# EAGLE design apple_all (EAGLE 9.6.1)
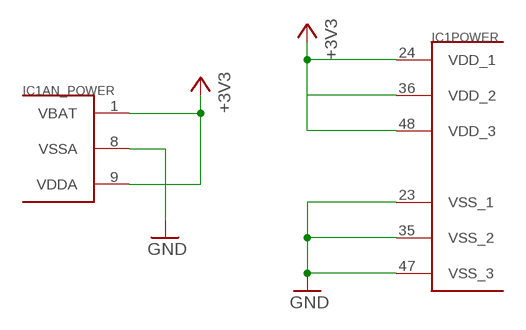
[diagram p0: schematic, sheet 1, part 1 of 2]
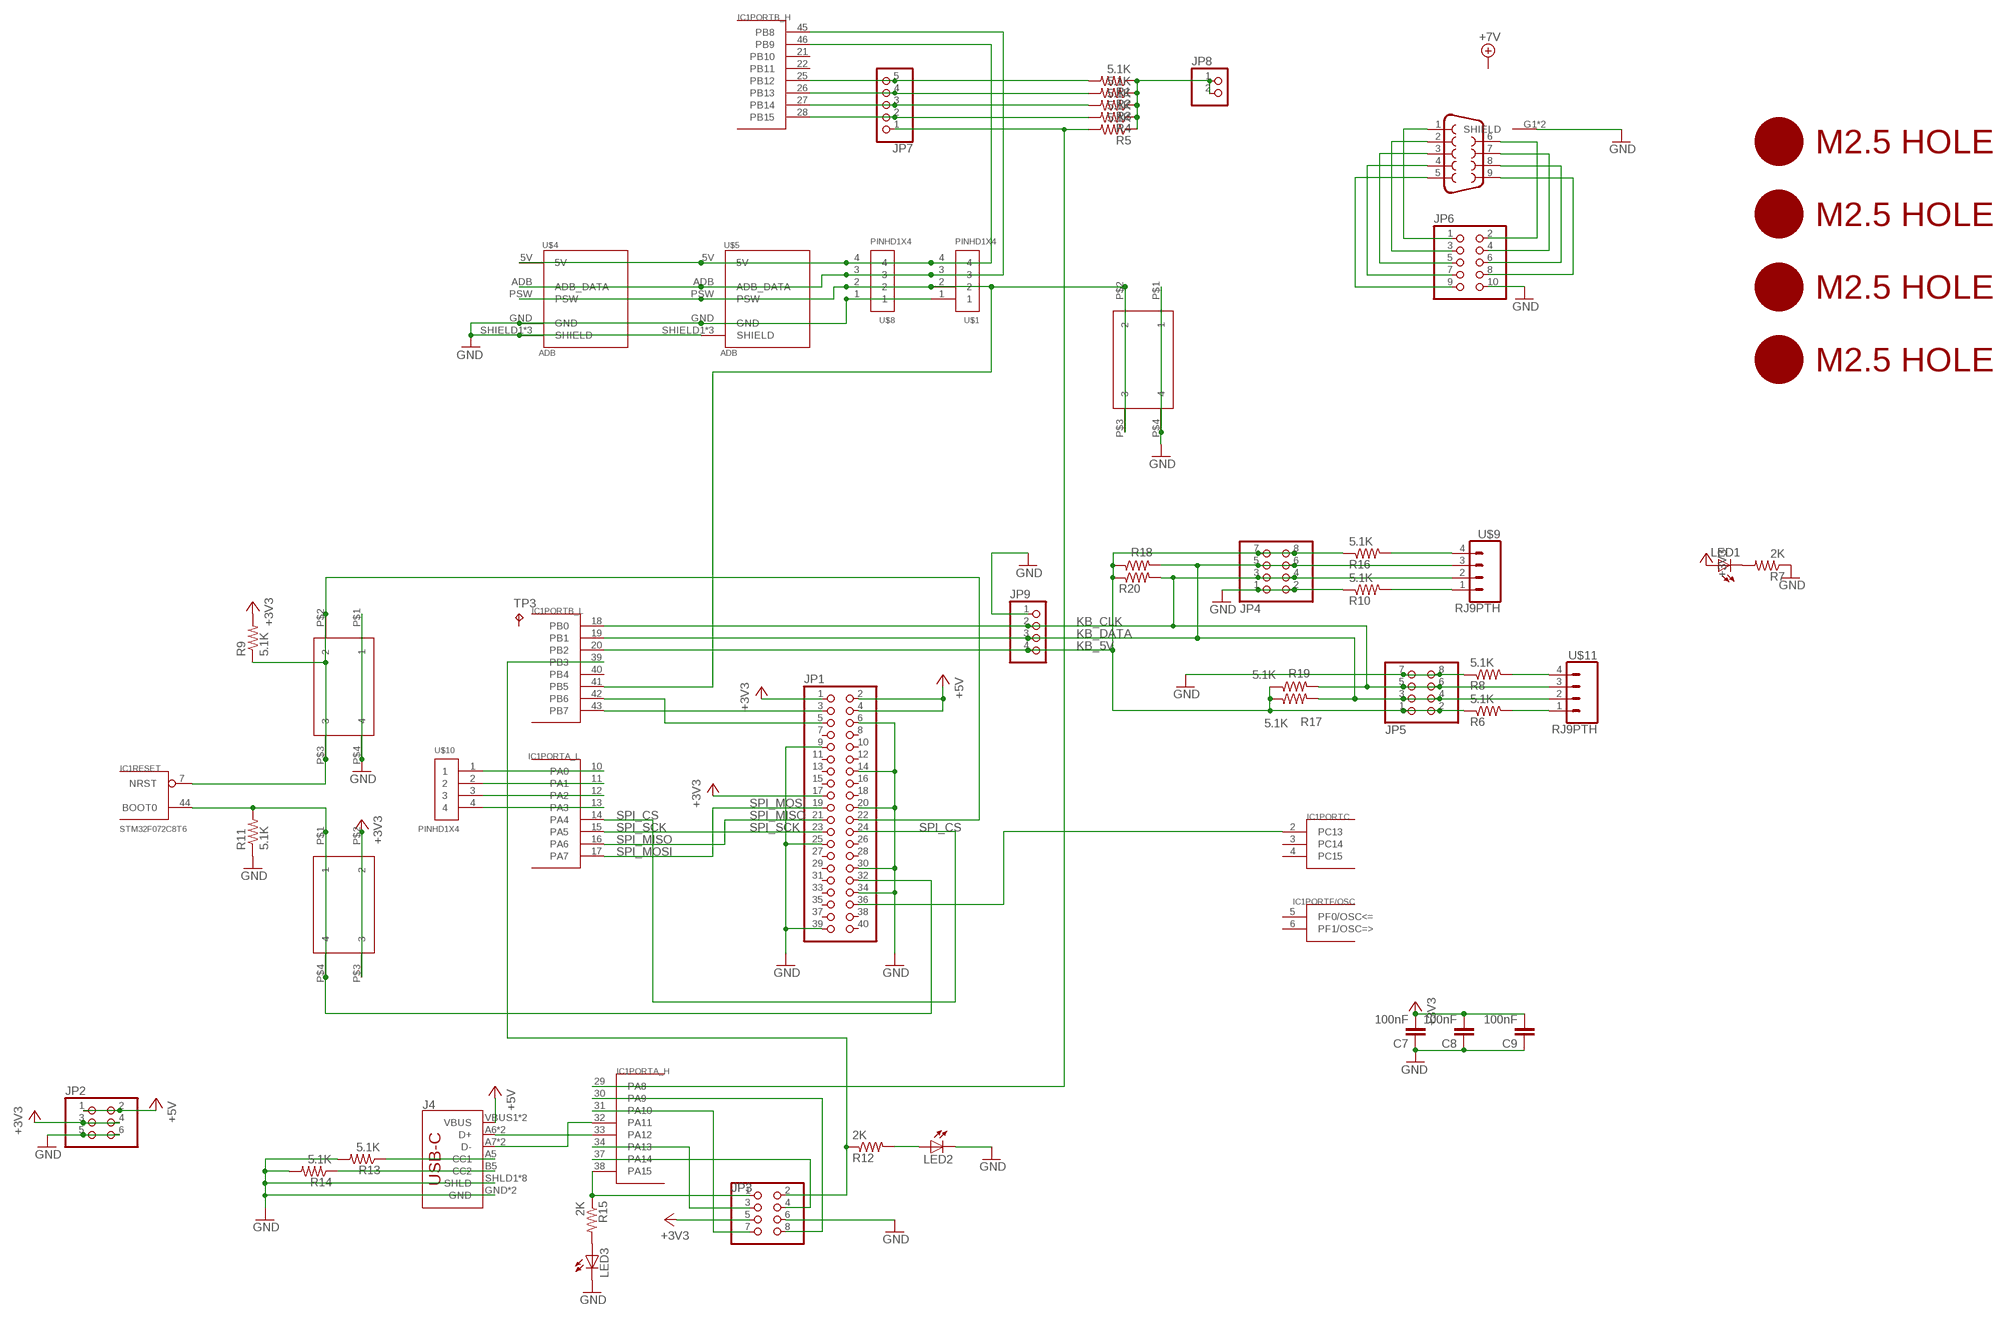
[diagram p1: schematic, sheet 1, part 2 of 2]

## Parts
C7  100nF  CAP0805  [0805@1]
C8  100nF  CAP0805  [0805@1]
C9  100nF  CAP0805  [0805@1]
IC1  STM32F072C8T6  [TQFP48]
J2  DB9FEMALE  [DB9]
J4  USB_C16PIN  [USB-C-16P]
JP1  PINHD-2X20-BIG  [2X20-BIG]
JP2  PINHD-2X3  [2X03]
JP3  PINHD-2X4  [2X04]
JP4  PINHD-2X4  [2X04]
JP5  PINHD-2X4  [2X04]
JP6  PINHD-2X5  [2X05]
JP7  PINHD-1X5  [1X05]
JP8  PINHD-1X2  [1X02]
JP9  PINHD-1X4  [1X04]
LED1  LEDCHIP-LED0805  [CHIP-LED0805]
LED2  LEDCHIP-LED0805  [CHIP-LED0805]
LED3  LEDCHIP-LED0805  [CHIP-LED0805]
R1  5.1K  RESISTOR0805-RES  [0805]
R2  5.1K  RESISTOR0805-RES  [0805]
R3  5.1K  RESISTOR0805-RES  [0805]
R4  5.1K  RESISTOR0805-RES  [0805]
R5  5.1K  RESISTOR0805-RES  [0805]
R6  5.1K  RESISTOR0805-RES  [0805]
R7  2K  RESISTOR0805-RES  [0805]
R8  5.1K  RESISTOR0805-RES  [0805]
R9  5.1K  RESISTOR0805-RES  [0805]
R10  5.1K  RESISTOR0805-RES  [0805]
R11  5.1K  RESISTOR0805-RES  [0805]
R12  2K  RESISTOR0805-RES  [0805]
R13  5.1K  RESISTOR0805-RES  [0805]
R14  5.1K  RESISTOR0805-RES  [0805]
R15  2K  RESISTOR0805-RES  [0805]
R16  5.1K  RESISTOR0805-RES  [0805]
R17  5.1K  RESISTOR0805-RES  [0805]
R18  5.1K  RESISTOR0805-RES  [0805]
R19  5.1K  RESISTOR0805-RES  [0805]
R20  5.1K  RESISTOR0805-RES  [0805]
SW1  324_SW  [342_SWICH_FOOT]
SW2  324_SW  [342_SWICH_FOOT]
SW3  324_SW  [342_SWICH_FOOT]
TP3  TPTP12R  [TP12R]
U$1  PINHD1X4  [1X04-CLEANBIG]
U$2  M2.5HOLE  [M2.5HOLE]
U$3  M2.5HOLE  [M2.5HOLE]
U$4  ADB  [DIN4]
U$5  ADB  [DIN4]
U$6  M2.5HOLE  [M2.5HOLE]
U$7  M2.5HOLE  [M2.5HOLE]
U$8  PINHD1X4  [1X04-CLEANBIG]
U$9  RJ9PTH  [RJ9]
U$10  PINHD1X4  [1X04-CLEANBIG]
U$11  RJ9PTH  [RJ9]

## Nets
+3V3: C7.2 C8.2 C9.2 IC1.1(AN_POWER:VBAT) IC1.9(AN_POWER:VDDA) IC1.24(POWER:VDD_1) IC1.36(POWER:VDD_2) IC1.48(POWER:VDD_3) JP1.1 JP1.17 JP2.3 JP2.4 JP3.5 LED1.A R9.2 SW2.P$2 SW2.P$3
+5V: J4.VBUS1(VBUS) J4.VBUS2(VBUS) JP1.2 JP1.4 JP2.1 JP2.2
GND: C7.1 C8.1 C9.1 IC1.8(AN_POWER:VSSA) IC1.23(POWER:VSS_1) IC1.35(POWER:VSS_2) IC1.47(POWER:VSS_3) J2.G1(SHIELD) J2.G2(SHIELD) J4.GND J4.GND2(GND) J4.SHLD1(SHLD) J4.SHLD2(SHLD) J4.SHLD3(SHLD) J4.SHLD4(SHLD) J4.SHLD5(SHLD) J4.SHLD6(SHLD) J4.SHLD7(SHLD) J4.SHLD8(SHLD) JP1.6 JP1.9 JP1.14 JP1.20 JP1.25 JP1.30 JP1.34 JP1.39 JP2.5 JP2.6 JP3.6 JP4.1 JP4.2 JP5.7 JP5.8 JP6.10 JP9.1 LED2.C LED3.C R7.1 R8.1 R10.1 R11.1 R13.2 R14.2 SW1.P$1 SW1.P$4 SW3.P$1 SW3.P$4 U$1.1 U$4.GND U$4.SHIELD1(SHIELD) U$4.SHIELD2(SHIELD) U$4.SHIELD3(SHIELD) U$5.GND U$5.SHIELD1(SHIELD) U$5.SHIELD2(SHIELD) U$5.SHIELD3(SHIELD) U$8.1
KB_5V: IC1.20(PORTB_L:PB2) JP4.7 JP4.8 JP5.1 JP5.2 JP9.4 R6.1 R16.1 R17.1 R18.1 R19.1 R20.1
KB_CLK: IC1.18(PORTB_L:PB0) JP4.3 JP4.4 JP5.5 JP5.6 JP9.2 R19.2 R20.2 U$9.2 U$11.3
KB_DATA: IC1.19(PORTB_L:PB1) JP4.5 JP4.6 JP5.3 JP5.4 JP9.3 R17.2 R18.2 U$9.3 U$11.2
N$1: J4.A5(CC1) R13.1
N$2: LED2.A R12.2
N$3: IC1.46(PORTB_H:PB9) U$1.4 U$4.5V U$5.5V U$8.4
N$4: IC1.28(PORTB_H:PB15) JP7.2 R4.2
N$5: R8.2 U$11.4
N$6: IC1.39(PORTB_L:PB3) JP3.2 R12.1
N$7: J4.B5(CC2) R14.1
N$8: IC1.33(PORTA_H:PA12) J4.A6(D+) J4.B6(D+)
N$9: IC1.32(PORTA_H:PA11) J4.A7(D-) J4.B7(D-)
N$10: IC1.27(PORTB_H:PB14) JP7.3 R3.2
N$12: IC1.31(PORTA_H:PA10) JP3.7
N$13: IC1.7(RESET:NRST) JP1.22 R9.1 SW1.P$2 SW1.P$3
N$14: IC1.30(PORTA_H:PA9) JP3.8
N$15: IC1.34(PORTA_H:PA13) JP3.3
N$16: IC1.37(PORTA_H:PA14) JP3.4
N$18: IC1.44(RESET:BOOT0) JP1.32 R11.2 SW2.P$1 SW2.P$4
N$22: IC1.42(PORTB_L:PB6) JP1.5
N$23: IC1.43(PORTB_L:PB7) JP1.3
N$26: J2.1 JP6.1
N$27: IC1.38(PORTA_H:PA15) JP3.1 R15.1
N$28: LED3.A R15.2
N$29: LED1.C R7.2
N$30: J2.2 JP6.3
N$31: J2.3 JP6.5
N$32: J2.4 JP6.7
N$33: J2.5 JP6.9
N$34: J2.6 JP6.2
N$35: J2.7 JP6.4
N$36: J2.8 JP6.6
N$37: IC1.2(PORTC:PC13) JP1.36
N$38: IC1.10(PORTA_L:PA0) U$10.1
N$39: IC1.11(PORTA_L:PA1) U$10.2
N$40: IC1.12(PORTA_L:PA2) U$10.3
N$41: IC1.13(PORTA_L:PA3) U$10.4
N$42: J2.9 JP6.8
N$43: IC1.45(PORTB_H:PB8) U$1.3 U$4.ADB(ADB_DATA) U$5.ADB(ADB_DATA) U$8.3
N$45: IC1.26(PORTB_H:PB13) JP7.4 R2.2
N$46: IC1.41(PORTB_L:PB5) SW3.P$2 SW3.P$3 U$1.2 U$4.PSW U$5.PSW U$8.2
N$47: IC1.25(PORTB_H:PB12) JP7.5 R1.2
N$48: IC1.29(PORTA_H:PA8) JP7.1 R5.2
N$49: JP8.1 JP8.2 R1.1 R2.1 R3.1 R4.1 R5.1
N$50: R6.2 U$11.1
N$51: R16.2 U$9.4
N$52: R10.2 U$9.1
SPI_CS: IC1.14(PORTA_L:PA4) JP1.24
SPI_MISO: IC1.16(PORTA_L:PA6) JP1.21
SPI_MOSI: IC1.17(PORTA_L:PA7) JP1.19
SPI_SCK: IC1.15(PORTA_L:PA5) JP1.23
Unconnected: IC1.3(PORTC:PC14) IC1.4(PORTC:PC15) IC1.5(PORTF/OSC:PF0/OSC<=) IC1.6(PORTF/OSC:PF1/OSC=>) IC1.21(PORTB_H:PB10) IC1.22(PORTB_H:PB11) IC1.40(PORTB_L:PB4) JP1.7 JP1.8 JP1.10 JP1.11 JP1.12 JP1.13 JP1.15 JP1.16 JP1.18 JP1.26 JP1.27 JP1.28 JP1.29 JP1.31 JP1.33 JP1.35 JP1.37 JP1.38 JP1.40 TP3.TP

## Library data of the parts
C7-C9 = clock:CAP: Capacitor Standard 0603 ceramic capacitor, and 0.1" leaded capacitor.
IC1 = clock:STM32F072C8T6: ST STM32F072 48pin LQFP
J2 = SparkFun-Connectors:DB9: DB9 Connector Standard DB9 (D-Sub 9) serial connector. Can be used for CAN bus as well as RS485 and RS232. Footprint production proven. Here is the female version connector we sell at SparkFun: 9 Pin Female Serial Connector - PCB Mount <https://www.sparkfun.com/products/429> (PRT-00429) This connector has been used on the following SparkFun products: SparkFun RS232 Shifter - SMD <https://www.sparkfun.com/products/449> (PRT-00449) SparkFun RS232 Shifter SMD (No DB9) <https://www.sparkfun.com/products/8780> (PRT-08780); PROD_ID: CONN-08194
J4 = SparkFun-Connectors:USB_C: USB Type C 16Pin Connector Super Speed pins not available on the 16-pin purely SMD connector so this part is best for USB 2.0 implementations. D1 and D2 are tied together enabling D+/- no matter which way the cable is plugged into the connector. The two channel configuration pins (CC1/2) are exposed. These are normally connected to ground via 5.1k resistors but can be reconfigured for high current/high power applications.; PROD_ID: CONN-14122
JP1 = adafruit_changed:PINHD-2X20: PIN HEADER
JP2 = pinhead:PINHD-2X3: PIN HEADER
JP3-JP5 = pinhead:PINHD-2X4: PIN HEADER
JP6 = pinhead:PINHD-2X5: PIN HEADER
JP7 = pinhead:PINHD-1X5: PIN HEADER
JP8 = pinhead:PINHD-1X2: PIN HEADER
JP9 = pinhead:PINHD-1X4: PIN HEADER
LED1-LED3 = adafruit:LED: LED OSRAM: - CHIPLED LG R971, LG N971, LY N971, LG Q971, LY Q971, LO R971, LY R971 LH N974, LH R974 LS Q976, LO Q976, LY Q976 LO Q996 - Hyper CHIPLED LW Q18S LB Q993, LB Q99A, LB R99A - SideLED LS A670, LO A670, LY A670, LG A670, LP A670 LB A673, LV A673, LT A673, LW A673 LH A674 LY A675 LS A676, LA A676, LO A676, LY A676, LW A676 LS A679, LY A679, LG A679 - Hyper Micro SIDELED® LS Y876, LA Y876, LO Y876, LY Y876 LT Y87S - SmartLED LW L88C, LW L88S LB L89C, LB L89S, LG L890 LS L89K, LO L89K, LY L89K LS L896, LA L896, LO L896, LY L896 - TOPLED LS T670, LO T670, LY T670, LG T670, LP T670 LSG T670, LSP T670, LSY T670, LOP T670, LYG T670 LG T671, LOG T671, LSG T671 LB T673, LV T673, LT T673, LW T673 LH T674 LS T676, LA T676, LO T676, LY T676, LB T676, LH T676, LSB T676, LW T676 LB T67C, LV T67C, LT T67C, LS T67K, LO T67K, LY T67K, LW E67C LS E67B, LA E67B, LO E67B, LY E67B, LB E67C, LV E67C, LT E67C LW T67C LS T679, LY T679, LG T679 LS T770, LO T770, LY T770, LG T770, LP T770 LB T773, LV T773, LT T773, LW T773 LH T774 LS E675, LA E675, LY E675, LS T675 LS T776, LA T776, LO T776, LY T776, LB T776 LHGB T686 LT T68C, LB T68C - Hyper Mini TOPLED® LB M676 - Mini TOPLED Santana® LG M470 LS M47K, LO M47K, LY M47K Source: http://www.osram.convergy.de/
R1-R20 = SparkFun-Passives:RESISTOR: Resistor Basic schematic elements and footprints for 0603, 1206, and PTH resistors.
SW1-SW3 = 3pos_slide_switch_centered:324_SW
TP3 = testpad:TP: Test pad
U$1 U$8 U$10 = adafruit_changed:PINHD1X4
U$2 U$3 U$6 U$7 = f1c100s:M2.5HOLE
U$4 U$5 = adb:ADB
U$9 U$11 = SparkFun-Retired:RJ9: This is a 4-pin connector commonly found on phone handsets. Great for simple TX/RX/PWR/GND connections. Sometime referred to as RJ9 or 4P4C. SparkFun does not currently use this on any active designs, and the connector alone has been retired. However, for more info visit here: https://www.sparkfun.com/products/retired/8694

## Net classes
1 power: width 0.178 mm

## Board
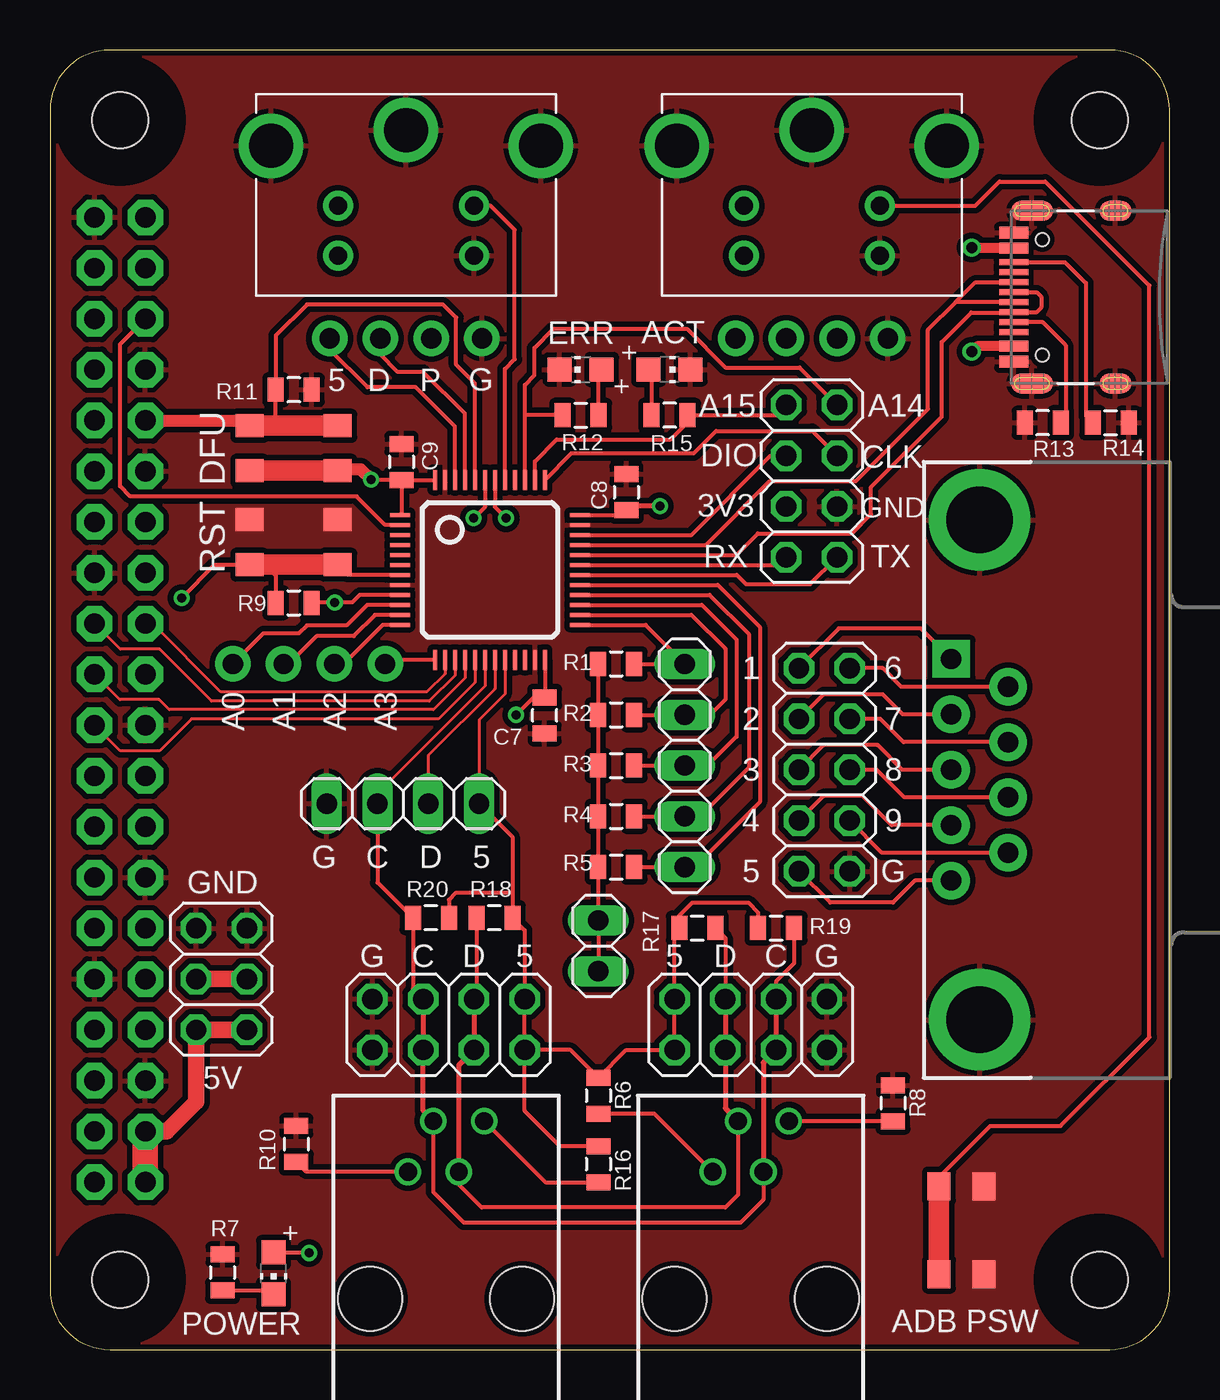
[diagram p2: board, top side]
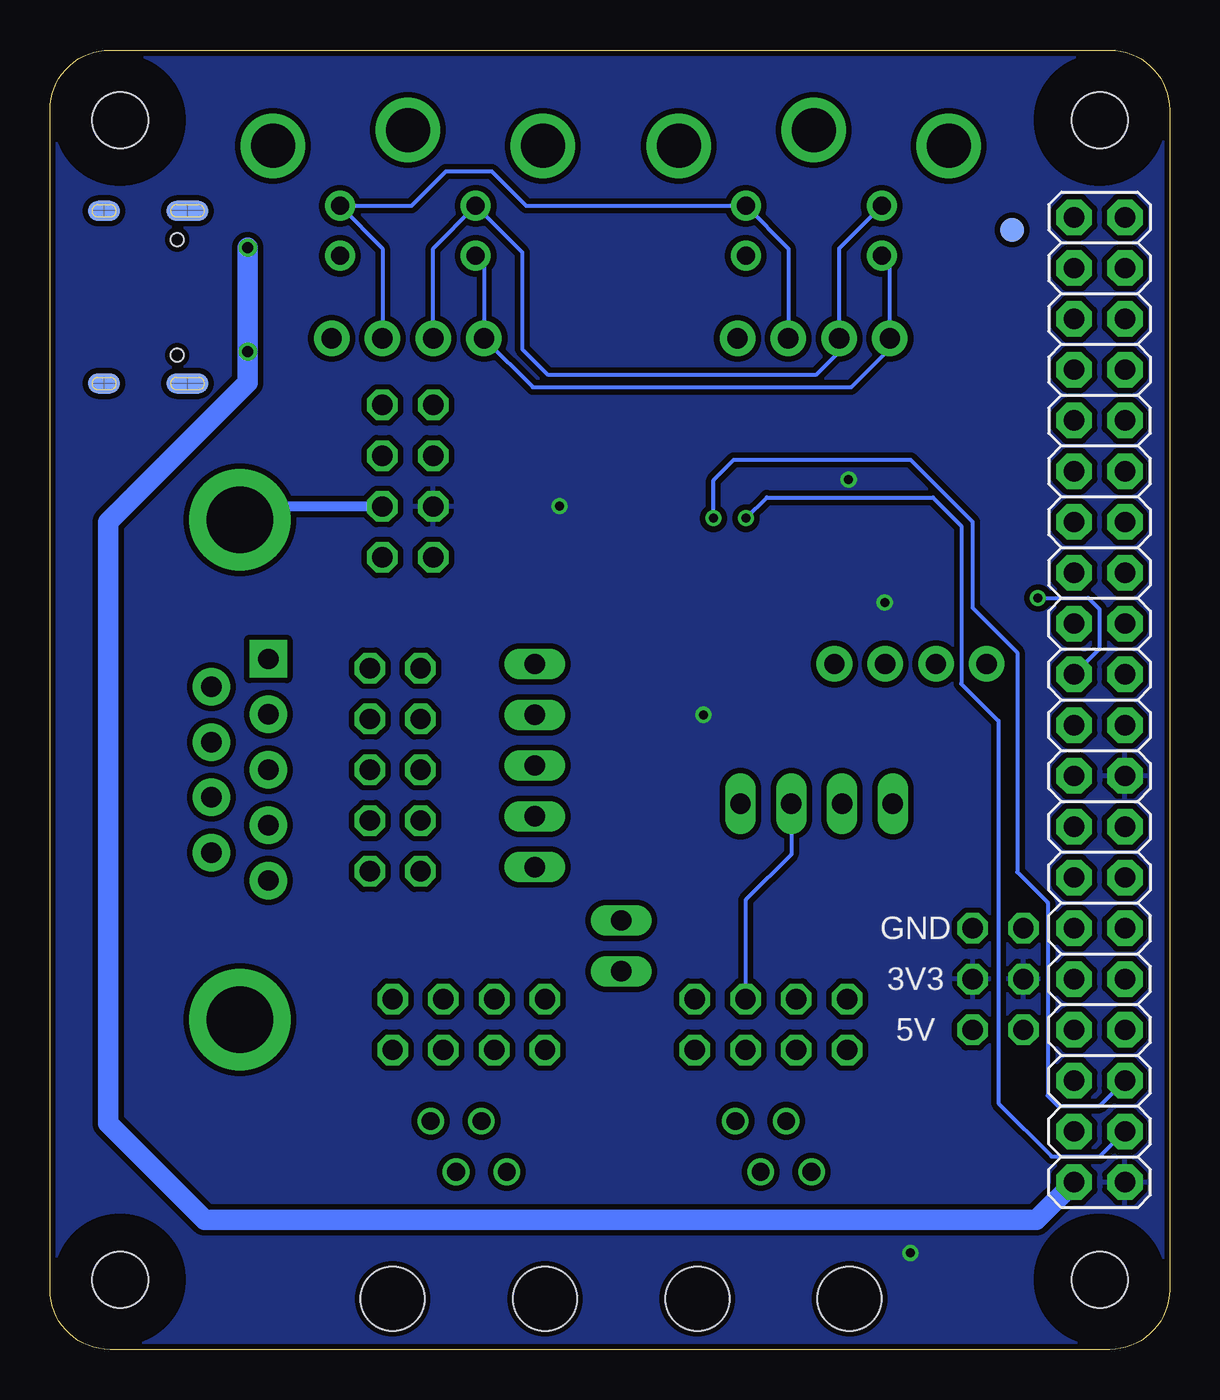
[diagram p3: board, bottom side, seen from below]

Size 56 x 65 mm. Coordinates in mm from the lower left corner, seen from the top.
Outline: 3,0 53,0 arc90 56,3 56,62 arc90 53,65 3,65 arc90 0,62 0,3 arc90 3,0
Copper layers (1*16): Top 0.035mm / dielectric 1.5mm / Bottom 0.035mm
Design rules "deku_2layer_6mil": minimum track width 6mil, minimum drill 15mil, track to track 6mil, track to pad 6mil, pad to pad 6mil, via to via 6mil, smd to smd 6mil, copper to edge 10mil, drill to drill 6mil, minimum pad ring 7mil, minimum via ring 7mil, stop-mask expansion 4mil, vias tented up to drill 25mil, thermal gap 10mil

### Footprints (pad centres in the part's own frame; a part is rotated, then mirrored left to right if it is on the bottom)
0805@1 = smd 0.8 x 1.2: 1 -0.9,0; 2 0.9,0
TQFP48 = smd 0.2 x 1: 1 -2.75,-4.5; 2 -2.25,-4.5; 3 -1.75,-4.5; 4 -1.25,-4.5; 5 -0.75,-4.5; 6 -0.25,-4.5; 7 0.25,-4.5; 8 0.75,-4.5; 9 1.25,-4.5; 10 1.75,-4.5; 11 2.25,-4.5; 12 2.75,-4.5; 25 2.75,4.5; 26 2.25,4.5; 27 1.75,4.5; 28 1.25,4.5; 29 0.75,4.5; 30 0.25,4.5; 31 -0.25,4.5; 32 -0.75,4.5; 33 -1.25,4.5; 34 -1.75,4.5; 35 -2.25,4.5; 36 -2.75,4.5 | smd 1 x 0.2: 13 4.5,-2.75; 14 4.5,-2.25; 15 4.5,-1.75; 16 4.5,-1.25; 17 4.5,-0.75; 18 4.5,-0.25; 19 4.5,0.25; 20 4.5,0.75; 21 4.5,1.25; 22 4.5,1.75; 23 4.5,2.25; 24 4.5,2.75; 37 -4.5,2.75; 38 -4.5,2.25; 39 -4.5,1.75; 40 -4.5,1.25; 41 -4.5,0.75; 42 -4.5,0.25; 43 -4.5,-0.25; 44 -4.5,-0.75; 45 -4.5,-1.25; 46 -4.5,-1.75; 47 -4.5,-2.25; 48 -4.5,-2.75
DB9 = drill 1.016 pad 1.88 square: 1 -5.54,-1.42 | drill 1.016 pad 1.88: 2 -2.77,-1.42; 3 0,-1.42; 4 2.77,-1.42; 5 5.54,-1.42; 6 -4.15,1.42; 7 -1.38,1.42; 8 1.38,1.42; 9 4.15,1.42 | drill 3.302 pad 5.08: G1 -12.5,0; G2 12.5,0
USB-C-16P = smd 0.3 x 1.45: A5 -1.25,0; A6 -0.25,0; A7 0.25,0; A8 1.25,0; B5 1.75,0; B6 0.75,0; B7 -0.75,0; B8 -1.75,0 | smd 0.6 x 1.45: GND -3.225,0; GND2 3.225,0 | smd 1 x 2.1: SHLD1 -4.32,-0.915; SHLD2 4.32,-0.915 | smd 1 x 2.1 bottom: SHLD3 -4.32,-0.915; SHLD4 4.32,-0.915 | smd 1 x 1.6: SHLD5 -4.32,-5.095; SHLD8 4.32,-5.095 | smd 1 x 1.6 bottom: SHLD6 -4.32,-5.095; SHLD7 4.32,-5.095 | smd 0.55 x 1.45: VBUS1 -2.45,0; VBUS2 2.45,0 | hole 0.65: -2.89,-1.445; 2.89,-1.445
2X20-BIG = drill 1.016 pad 1.778 octagon: 1 -24.13,-1.27; 2 -24.13,1.27; 3 -21.59,-1.27; 4 -21.59,1.27; 5 -19.05,-1.27; 6 -19.05,1.27; 7 -16.51,-1.27; 8 -16.51,1.27; 9 -13.97,-1.27; 10 -13.97,1.27; 11 -11.43,-1.27; 12 -11.43,1.27; 13 -8.89,-1.27; 14 -8.89,1.27; 15 -6.35,-1.27; 16 -6.35,1.27; 17 -3.81,-1.27; 18 -3.81,1.27; 19 -1.27,-1.27; 20 -1.27,1.27; 21 1.27,-1.27; 22 1.27,1.27; 23 3.81,-1.27; 24 3.81,1.27; 25 6.35,-1.27; 26 6.35,1.27; 27 8.89,-1.27; 28 8.89,1.27; 29 11.43,-1.27; 30 11.43,1.27; 31 13.97,-1.27; 32 13.97,1.27; 33 16.51,-1.27; 34 16.51,1.27; 35 19.05,-1.27; 36 19.05,1.27; 37 21.59,-1.27; 38 21.59,1.27; 39 24.13,-1.27; 40 24.13,1.27
2X03 = drill 1.016 octagon: 1 -2.54,-1.27; 2 -2.54,1.27; 3 0,-1.27; 4 0,1.27; 5 2.54,-1.27; 6 2.54,1.27
2X04 = drill 1.016 octagon: 1 -3.81,-1.27; 2 -3.81,1.27; 3 -1.27,-1.27; 4 -1.27,1.27; 5 1.27,-1.27; 6 1.27,1.27; 7 3.81,-1.27; 8 3.81,1.27
2X05 = drill 1.016 octagon: 1 -5.08,-1.27; 2 -5.08,1.27; 3 -2.54,-1.27; 4 -2.54,1.27; 5 0,-1.27; 6 0,1.27; 7 2.54,-1.27; 8 2.54,1.27; 9 5.08,-1.27; 10 5.08,1.27
1X05 = drill 1.016 long: 1 -5.08,0; 2 -2.54,0; 3 0,0; 4 2.54,0; 5 5.08,0
1X02 = drill 1.016 long: 1 -1.27,0; 2 1.27,0
1X04 = drill 1.016 long: 1 -3.81,0; 2 -1.27,0; 3 1.27,0; 4 3.81,0
CHIP-LED0805 = smd 1.2 x 1.2: A 0,-1.05; C 0,1.05
0805 = smd 0.8 x 1.2: 1 -0.9,0; 2 0.9,0
342_SWICH_FOOT = smd 1.4 x 1.15: P$1 -2.2,-1.125; P$2 -2.2,1.125; P$3 2.2,1.125; P$4 2.2,-1.125
TP12R = smd 1.2 x 1.2: TP 0,0
1X04-CLEANBIG = drill 1.016 pad 1.778: 1 -3.81,0; 2 -1.27,0; 3 1.27,0; 4 3.81,0
M2.5HOLE = hole 2.8: 0,0
DIN4 = drill 0.9 pad 1.5: 5V -3.4,-6.3; ADB -3.4,-3.8; GND 3.4,-6.3; PSW 3.4,-3.8 | drill 2.2: SHIELD1 -6.75,-0.8; SHIELD2 0,0; SHIELD3 6.75,-0.8
RJ9 = drill 0.889: 1 -1.905,6.35; 2 -0.635,8.89; 3 0.635,6.35; 4 1.905,8.89 | hole 3.2: -3.81,0; 3.81,0

### Placement (x,y rotation side)
C7  24.74,31.72 90 top
C8  28.83,42.88 270 top
C9  17.58,44.4 270 top
IC1  22,39 270 top
J2  46.5,29 270 top
J4  48.2,52.63 90 top
JP1  3.5,32.5 90 bottom
JP2  8.58,18.53 90 top
JP3  38.1,43.43 270 top
JP4  19.94,16.26 0 top
JP5  35.05,16.26 0 top
JP6  38.73,29 270 top
JP7  31.75,29.21 90 top
JP8  27.43,20.19 90 top
JP9  17.65,27.3 0 top
LED1  11.18,3.81 180 top
LED2  26.54,49.02 90 top
LED3  30.99,49.02 270 top
R1  28.32,34.29 0 top
R2  28.32,31.75 0 top
R3  28.32,29.21 0 top
R4  28.32,26.67 0 top
R5  28.32,24.13 0 top
R6  27.43,12.7 270 top
R7  8.64,3.86 270 top
R8  42.16,12.32 270 top
R9  12.19,37.34 0 top
R10  12.32,10.29 270 top
R11  12.19,48.01 180 top
R12  26.54,46.74 0 top
R13  49.66,46.35 180 top
R14  53.06,46.35 0 top
R15  30.99,46.74 180 top
R16  27.43,9.27 270 top
R17  32.38,21.08 0 top
R18  22.23,21.59 180 top
R19  36.32,21.08 0 top
R20  19.05,21.59 180 top
SW1  12.19,40.39 180 top
SW2  12.19,45.09 180 top
SW3  45.59,5.97 90 top
TP3  7.87,56.01 0 bottom
U$1  17.8,50.57 180 top
U$2  3.5,3.5 0 top
U$3  52.5,3.5 0 top
U$4  17.8,61 0 top
U$5  38.1,61 0 top
U$6  3.5,61.5 0 top
U$7  52.5,61.5 0 top
U$8  38.1,50.57 180 top
U$9  19.81,2.54 0 top
U$10  12.95,34.29 0 top
U$11  35.05,2.54 0 top

### Tracks (layer width: path | path; a pad name or v marks a point on that pad's centre or on a via)
+3V3  (via drill 0.45)
  Top 0.203: v16.05,43.51 17.57,43.51 C9.2 | C9.2 IC1.48 | C9.2 17.58,41.83 IC1.1 | R9.2 13.12,37.36 v14.25,37.36 15.11,37.36 15.5,37.75 IC1.9 | IC1.36 28.63,41.75 28.84,41.96 29.07,42.19 | v23.32,31.75 24.19,32.62 C7.2 24.75,32.63 IC1.24 | LED1.A 12.92,4.86 v12.95,4.83
  Top 0.254: v30.5,42.19 29.07,42.19 | 28.84,41.96 C8.2
  Top 0.61: v16.05,43.51 15.54,44.02 14.45,44.02 SW2.P$2
  Top 0.813: JP2.3 JP2.4
  Top 1.016: SW2.P$3 SW2.P$2
  pour Bottom (isolate 0.279, rank 2): 0,3 0,62 arc-90 3,65 53,65 arc-90 56,62 56,3 arc-90 53,0 3,0 arc-90
+5V  (via drill 0.55)
  Top 0.508: J4.VBUS2 46.13,55.09 v46.1,55.12 | J4.VBUS1 46.38,50.19 v46.1,49.91
  Top 0.813: JP1.4 5.83,10.91 7.31,12.39 JP2.2 JP2.1
  Top 1.27: JP1.4 JP1.2
  Bottom 1.016: JP1.2 6.66,6.48 48.26,6.48 53.09,11.3 53.09,41.38 46.1,48.36 v46.1,49.91 v46.1,55.12
GND
  Bottom 0.508: JP3.6 45.84,42.16 J2.G1
  pour Top (isolate 0.279): 3,0 53,0 arc90 56,3 56,62 arc90 53,65 3,65 arc90 0,62 0,3 arc90
KB_5V
  Top 0.152: IC1.20 22.75,32.78 21.46,31.5 JP9.4
  Top 0.203: R19.1 35.42,21.86 34.92,22.35 32.13,22.35 31.48,21.71 R17.1 31.24,20.84 JP5.2 JP5.1 28.82,14.99 R6.1 26.05,14.99 JP4.7 | R16.1 25.52,10.17 23.75,11.94 JP4.7 | JP4.7 JP4.8 23.75,20.97 R18.1 23.12,22.86 | R20.1 19.95,22.49 20.32,22.86 23.12,22.86 | JP9.4 23.12,25.64 23.12,22.86
KB_CLK
  Top 0.152: IC1.18 21.75,33.18 16.38,27.81 JP9.2
  Top 0.203: R19.2 37.22,19.32 36.32,18.41 JP5.6 | JP4.4 18.15,18.05 R20.2 16.38,23.36 JP9.2 | U$11.3 35.69,7.49 34.54,6.35 20.7,6.35 19.18,7.87 U$9.2
  Top 0.254: U$11.3 35.69,14.35 JP5.5 JP5.6 | U$9.2 18.67,11.94 JP4.3 JP4.4
KB_DATA
  Top 0.152: IC1.19 22.25,33.05 18.92,29.72 JP9.3
  Top 0.203: R17.2 33.78,20.59 JP5.4 | R18.2 21.32,17.64 JP4.6 | U$11.2 34.42,7.75 33.78,7.11 21.59,7.11 20.45,8.26 U$9.3
  Top 0.254: U$11.2 33.78,12.06 JP5.3 JP5.4 | U$9.3 20.45,14.22 JP4.5 JP4.6
  Bottom 0.203: JP9.3 18.92,24.77 21.21,22.48 JP4.6
N$1
  Top 0.203: R13.1 50.81,46.61 50.81,50.23 49.66,51.38 J4.A5
N$2
  Top 0.203: R12.2 27.44,48.87 LED2.A
N$3
  Top 0.203: IC1.46 20.25,46.17 18.29,48.13 15.88,48.13 13.99,50.02 U$1.4
  Bottom 0.203: U$4.5V 14.02,54.32 14.02,50.6 U$1.4 13.99,50.07 15.92,48.13 31.85,48.13 U$8.4 34.29,54.29 U$5.5V
N$4
  Top 0.203: IC1.28 32.99,37.75 34.95,35.79 34.95,29.11 32.51,26.67 JP7.2 R4.2
N$5
  Top 0.203: U$11.4 R8.2
N$6
  Top 0.203: JP3.2 37.49,49.12 33.78,49.12 31.85,51.05 25.2,51.05 24.23,50.09 24.23,48.73 23.75,48.25 23.75,46.74 | IC1.39 23.75,46.74 | R12.1 23.75,46.74
N$7
  Top 0.203: J4.B5 50.77,54.38 51.82,53.34 51.82,46.7 R14.1
N$8
  Top 0.203: IC1.33 32.81,40.25 35.99,43.43 40.31,43.43 43.92,47.04 43.92,51 45.29,52.38 45.3,52.38 | J4.B6 46.3,53.38 45.3,52.38 | J4.A6 45.3,52.38
N$9
  Top 0.152: 48.22,51.87 J4.B7
  Top 0.203: IC1.32 34.34,39.75 35.41,40.82 40.11,40.82 41.07,41.78 41.07,43.13 44.6,46.66 44.6,50.39 46.08,51.87 48.22,51.87 49.33,51.87 49.58,52.12 49.58,52.65 49.35,52.88 J4.A7
N$10
  Top 0.203: IC1.27 32.6,37.25 34.34,35.51 34.34,30.66 32.89,29.21 JP7.3 R3.2
N$12
  Top 0.203: IC1.31 36.46,39.25 JP3.7
N$13  (via drill 0.45)
  Top 0.203: IC1.7 14.9,38.75 SW1.P$2 | 10.74,39.26 11.29,38.71 R9.1 | v6.58,37.59 8.25,39.26 SW1.P$3
  Top 1.016: SW1.P$3 10.74,39.26 SW1.P$2
  Bottom 0.203: JP1.22 3.5,35.03 3.5,37.03 4.06,37.59 v6.58,37.59
N$14
  Top 0.203: IC1.30 34.35,38.75 34.82,38.28 38.02,38.28 JP3.8
N$15
  Top 0.203: IC1.34 32.09,40.75 36.04,44.7 JP3.3
N$16
  Top 0.203: IC1.37 26.08,44.83 32.21,44.83 33.33,45.95 38.12,45.95 JP3.4
N$18
  Top 0.203: 11.28,46.21 11.28,47.99 R11.2 11.29,50.71 12.85,52.27 19.66,52.27 20.32,51.61 20.32,49.25 21.25,48.32 IC1.44
  Top 0.61: JP1.32 9.73,46.47 SW2.P$4
  Top 1.016: SW2.P$4 11.28,46.21 SW2.P$1
N$22  (via drill 0.45)
  Top 0.203: IC1.42 22.25,42.14 v22.81,41.58
  Bottom 0.203: v22.81,41.58 22.81,43.48 21.79,44.5 12.95,44.5 9.86,41.4 9.86,37.11 7.62,34.87 7.62,23.88 6.1,22.35 6.1,12.7 5.59,12.19 3.49,12.19 JP1.5
N$23  (via drill 0.45)
  Top 0.203: IC1.43 21.75,42.15 v21.18,41.58
  Bottom 0.203: v21.18,41.58 20.14,42.62 11.84,42.62 10.41,41.2 10.41,33.3 8.56,31.45 8.56,12.32 5.89,9.65 3.49,9.65 JP1.3
N$26
  Top 0.203: J2.1 43.55,36.07 39.45,36.07 JP6.1
N$27
  Top 0.203: IC1.38 24.25,44.42 25.35,45.52 31.05,45.52 31.89,46.35 R15.1 36.32,46.74 JP3.1
N$28
  Top 0.203: LED3.A 30.09,48.87 R15.2
N$29
  Top 0.203: R7.2 10.97,2.96 LED1.C
N$30
  Top 0.203: J2.2 42.65,31.77 41.66,32.77 38.69,32.77 JP6.3
N$31
  Top 0.203: J2.3 42.63,29 41.4,30.23 38.69,30.23 JP6.5
N$32
  Top 0.203: J2.4 42.1,26.23 40.64,27.69 38.69,27.69 JP6.7
N$33
  Top 0.203: J2.5 43.27,23.46 42.16,22.35 39.03,22.35 JP6.9
N$34
  Top 0.203: J2.6 42.59,33.15 41.66,34.08 JP6.2
N$35
  Top 0.203: J2.7 42.69,30.38 41.53,31.54 JP6.4
N$36
  Top 0.203: J2.8 42.74,27.62 41.36,29 JP6.6
N$37
  Top 0.203: IC1.2 16.76,41.25 15.34,42.67 4.01,42.67 3.5,43.18 3.5,50.28 JP1.36
N$38
  Top 0.203: IC1.10 15.86,37.25 14.83,36.22 12.85,36.22 12.45,35.81 10.67,35.81 U$10.1
N$39
  Top 0.203: IC1.11 16.25,36.75 15.19,35.69 13.34,35.69 11.94,34.29 U$10.2
N$40
  Top 0.203: IC1.12 16.64,36.25 14.68,34.29 U$10.3
N$41
  Top 0.203: IC1.13 16.97,34.5 U$10.4
N$42
  Top 0.203: J2.9 41.62,24.85 JP6.8
N$43
  Top 0.203: IC1.45 20.75,46.81 18.67,48.9 17.4,48.9 16.53,49.76 U$1.3
  Bottom 0.203: U$4.ADB 16.53,55.07 U$1.3 16.53,49.89 17.65,48.77 31.11,48.77 32.38,50.04 32.38,54.88 U$5.ADB 36.83,55.07 U$8.3
N$45
  Top 0.203: IC1.26 32.08,36.75 33.78,35.05 33.78,32.51 33.02,31.75 JP7.4 R2.2
N$46
  Top 0.203: IC1.41 22.75,49.04 23.24,49.53 23.24,56.01 22.05,57.2 U$4.PSW | U$5.PSW 46.28,57.2 47.5,58.42 49.78,58.42 54.99,53.21 54.99,15.62 50.55,11.18 47.03,11.18 44.47,8.62 SW3.P$3
  Top 1.016: SW3.P$2 SW3.P$3
  Bottom 0.203: U$1.2 19.07,55.07 U$4.PSW 32.18,57.2 33.91,58.93 36.2,58.93 37.92,57.2 U$5.PSW 39.37,55.07 U$8.2
N$47
  Top 0.203: IC1.25 29.79,36.25 JP7.5 R1.2
N$48
  Top 0.203: IC1.29 33.4,38.25 35.51,36.14 35.51,27.38 32.26,24.13 JP7.1 R5.2
N$49
  Top 0.203: R1.1 R2.1 R3.1 R4.1 R5.1 27.42,21.47 JP8.2 JP8.1
N$50
  Top 0.203: U$11.1 30.24,11.8 R6.2
N$51
  Top 0.203: U$9.4 24.78,8.37 R16.2
N$52
  Top 0.203: U$9.1 12.82,8.89 R10.2
SPI_CS
  Top 0.152: IC1.14 19.75,33.8 18.85,32.89 8.54,32.89 5.13,36.31 JP1.24
SPI_MISO
  Top 0.152: IC1.16 20.75,33.58 19.18,32 5.97,32 5.46,32.51 3.49,32.51 JP1.21
SPI_MOSI
  Top 0.152: JP1.19 3.51,29.95 5.49,29.95 7.09,31.55 19.43,31.55 21.25,33.37 IC1.17
SPI_SCK
  Top 0.152: IC1.15 20.25,33.71 18.97,32.44 8.08,32.44 5.49,35.03 3.51,35.03 JP1.23

### Text on the board
tNames: ERR | ACT | G | 5 | D | P | A15 | A14 | DFU | DIO | CLK | 3V3 | GND | RST | RX | TX | 1 | 6 | A0 | A1 | A2 | A3 | 2 | 7 | 3 | 8 | 4 | 9 | G | C | D | 5 | 5 | G | GND | G | C | D | 5 | 5 | D | C | G | 5V | POWER | ADB PSW
bNames: GND | 3V3 | 5V